# EAGLE design controller_v1.1B (EAGLE 7.2.0)
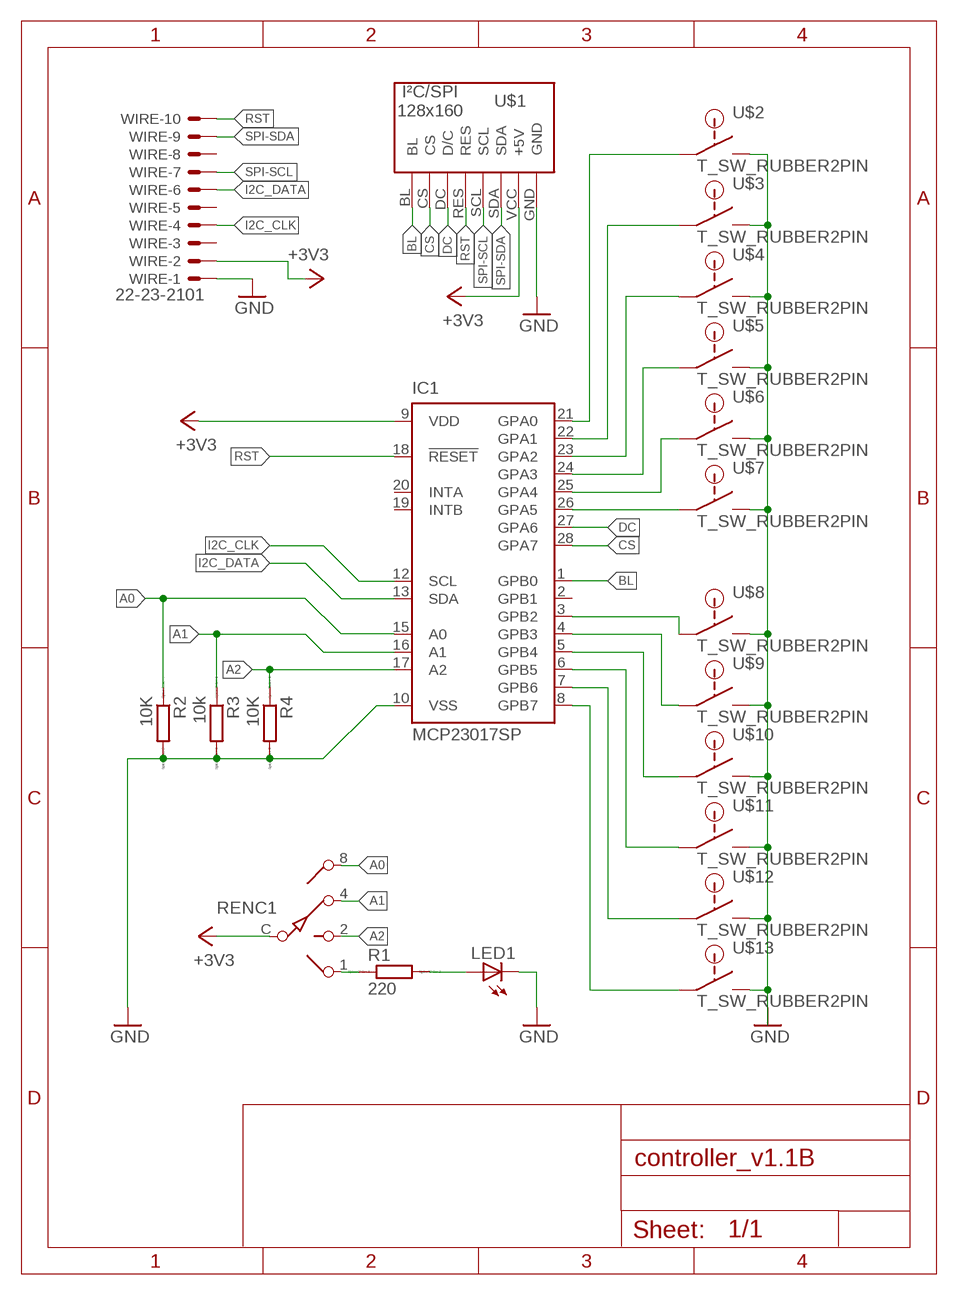
[diagram p0: schematic, sheet 1]

## Parts
IC1  MCP23017SP  [DIL28-3]
LED1  LED3MM  [LED3MM]
R1  220  R0207/10  [0207/10]
R2  10K  R0207/10  [0207/10]
R3  10k  R0207/10  [0207/10]
R4  10K  R0207/10  [0207/10]
RENC1  SW-C10  [SW-C10]
U$1  ST7735_128X160  [128X160_ST7735]
U$2  T_SW_RUBBER2PIN  [2PIN]
U$3  T_SW_RUBBER2PIN  [2PIN]
U$4  T_SW_RUBBER2PIN  [2PIN]
U$5  T_SW_RUBBER2PIN  [2PIN]
U$6  T_SW_RUBBER2PIN  [2PIN]
U$7  T_SW_RUBBER2PIN  [2PIN]
U$8  T_SW_RUBBER2PIN  [2PIN]
U$9  T_SW_RUBBER2PIN  [2PIN]
U$10  T_SW_RUBBER2PIN  [2PIN]
U$11  T_SW_RUBBER2PIN  [2PIN]
U$12  T_SW_RUBBER2PIN  [2PIN]
U$13  T_SW_RUBBER2PIN  [2PIN]
WIRE  22-23-2101  [22-23-2101]

## Nets
+3V3: IC1.9(VDD) RENC1.C U$1.VCC(+5V) WIRE.2
A0: IC1.15(A0) R2.1 RENC1.8
A1: IC1.16(A1) R3.1 RENC1.4
A2: IC1.17(A2) R4.1 RENC1.2
BL: IC1.1(GPB0) U$1.BL
CS: IC1.28(GPA7) U$1.CS
DC: IC1.27(GPA6) U$1.DC(D/C)
GND: IC1.10(VSS) LED1.K(C) R2.2 R3.2 R4.2 U$1.GND U$2.P$3 U$3.P$3 U$4.P$3 U$5.P$3 U$6.P$3 U$7.P$3 U$8.P$3 U$9.P$3 U$10.P$3 U$11.P$3 U$12.P$3 U$13.P$3 WIRE.1
I2C_CLK: IC1.12(SCL) WIRE.4
I2C_DATA: IC1.13(SDA) WIRE.6
N$1: IC1.21(GPA0) U$2.P$2
N$2: R1.1 RENC1.1
N$3: LED1.A R1.2
N$4: IC1.25(GPA4) U$6.P$2
N$5: IC1.24(GPA3) U$5.P$2
N$6: IC1.23(GPA2) U$4.P$2
N$7: IC1.22(GPA1) U$3.P$2
RST: IC1.18(!RESET) U$1.RES WIRE.10
SPI-SCL: U$1.SCL WIRE.7
SPI-SDA: U$1.SDA WIRE.9
SW6: IC1.26(GPA5) U$7.P$2
SW7: IC1.3(GPB2) U$8.P$2
SW8: IC1.4(GPB3) U$9.P$2
SW9: IC1.5(GPB4) U$10.P$2
SW10: IC1.6(GPB5) U$11.P$2
SW11: IC1.7(GPB6) U$12.P$2
SW12: IC1.8(GPB7) U$13.P$2
Unconnected: IC1.2(GPB1) IC1.19(INTB) IC1.20(INTA) WIRE.3 WIRE.5 WIRE.8

## Library data of the parts
IC1 = microchip:MCP23017: http://ww1.microchip.com/downloads/en/DeviceDoc/21952a.pdf Source: http://ww1.microchip.com/downloads/en/DeviceDoc/21952a.pdf; MF: MICROCHIP; MPN: MCP23017-E/SP; OC_FARNELL: 1332088; OC_NEWARK: 31K2959
LED1 = led:LED: LED OSRAM: - CHIPLED LG R971, LG N971, LY N971, LG Q971, LY Q971, LO R971, LY R971 LH N974, LH R974 LS Q976, LO Q976, LY Q976 LO Q996 - Hyper CHIPLED LW Q18S LB Q993, LB Q99A, LB R99A - SideLED LS A670, LO A670, LY A670, LG A670, LP A670 LB A673, LV A673, LT A673, LW A673 LH A674 LY A675 LS A676, LA A676, LO A676, LY A676, LW A676 LS A679, LY A679, LG A679 - Hyper Micro SIDELED® LS Y876, LA Y876, LO Y876, LY Y876 LT Y87S - SmartLED LW L88C, LW L88S LB L89C, LB L89S, LG L890 LS L89K, LO L89K, LY L89K LS L896, LA L896, LO L896, LY L896 - TOPLED LS T670, LO T670, LY T670, LG T670, LP T670 LSG T670, LSP T670, LSY T670, LOP T670, LYG T670 LG T671, LOG T671, LSG T671 LB T673, LV T673, LT T673, LW T673 LH T674 LS T676, LA T676, LO T676, LY T676, LB T676, LH T676, LSB T676, LW T676 LB T67C, LV T67C, LT T67C, LS T67K, LO T67K, LY T67K, LW E67C LS E67B, LA E67B, LO E67B, LY E67B, LB E67C, LV E67C, LT E67C LW T67C LS T679, LY T679, LG T679 LS T770, LO T770, LY T770, LG T770, LP T770 LB T773, LV T773, LT T773, LW T773 LH T774 LS E675, LA E675, LY E675, LS T675 LS T776, LA T776, LO T776, LY T776, LB T776 LHGB T686 LT T68C, LB T68C - Hyper Mini TOPLED® LB M676 - Mini TOPLED Santana® LG M470 LS M47K, LO M47K, LY M47K Source: http://www.osram.convergy.de LUXEON: - LUMILED® LXK2-PW12-R00, LXK2-PW12-S00, LXK2-PW14-U00, LXK2-PW14-V00 LXK2-PM12-R00, LXK2-PM12-S00, LXK2-PM14-U00 LXK2-PE12-Q00, LXK2-PE12-R00, LXK2-PE12-S00, LXK2-PE14-T00, LXK2-PE14-U00 LXK2-PB12-K00, LXK2-PB12-L00, LXK2-PB12-M00, LXK2-PB14-N00, LXK2-PB14-P00, LXK2-PB14-Q00 LXK2-PR12-L00, LXK2-PR12-M00, LXK2-PR14-Q00, LXK2-PR14-R00 LXK2-PD12-Q00, LXK2-PD12-R00, LXK2-PD12-S00 LXK2-PH12-R00, LXK2-PH12-S00 LXK2-PL12-P00, LXK2-PL12-Q00, LXK2-PL12-R00 Source: www.luxeon.com KINGBRIGHT: KA-3528ASYC Source: www.kingbright.com
R1-R4 = eagle-ltspice:R: RESISTOR, European symbol; SPICEMODEL: NONE; SPICEPREFIX: R
RENC1 = special:SW-C10: SWITCH 10-step rotary switch
U$1 = display:ST7735_128X160
U$2-U$13 = switch:T_SW_RUBBER
WIRE = con-molex:22-23-2101: .100" (2.54mm) Center Header - 10 Pin; MF: MOLEX; MPN: Wire-connection; OC_FARNELL: 1756828; OC_NEWARK: 94C0765

## Board
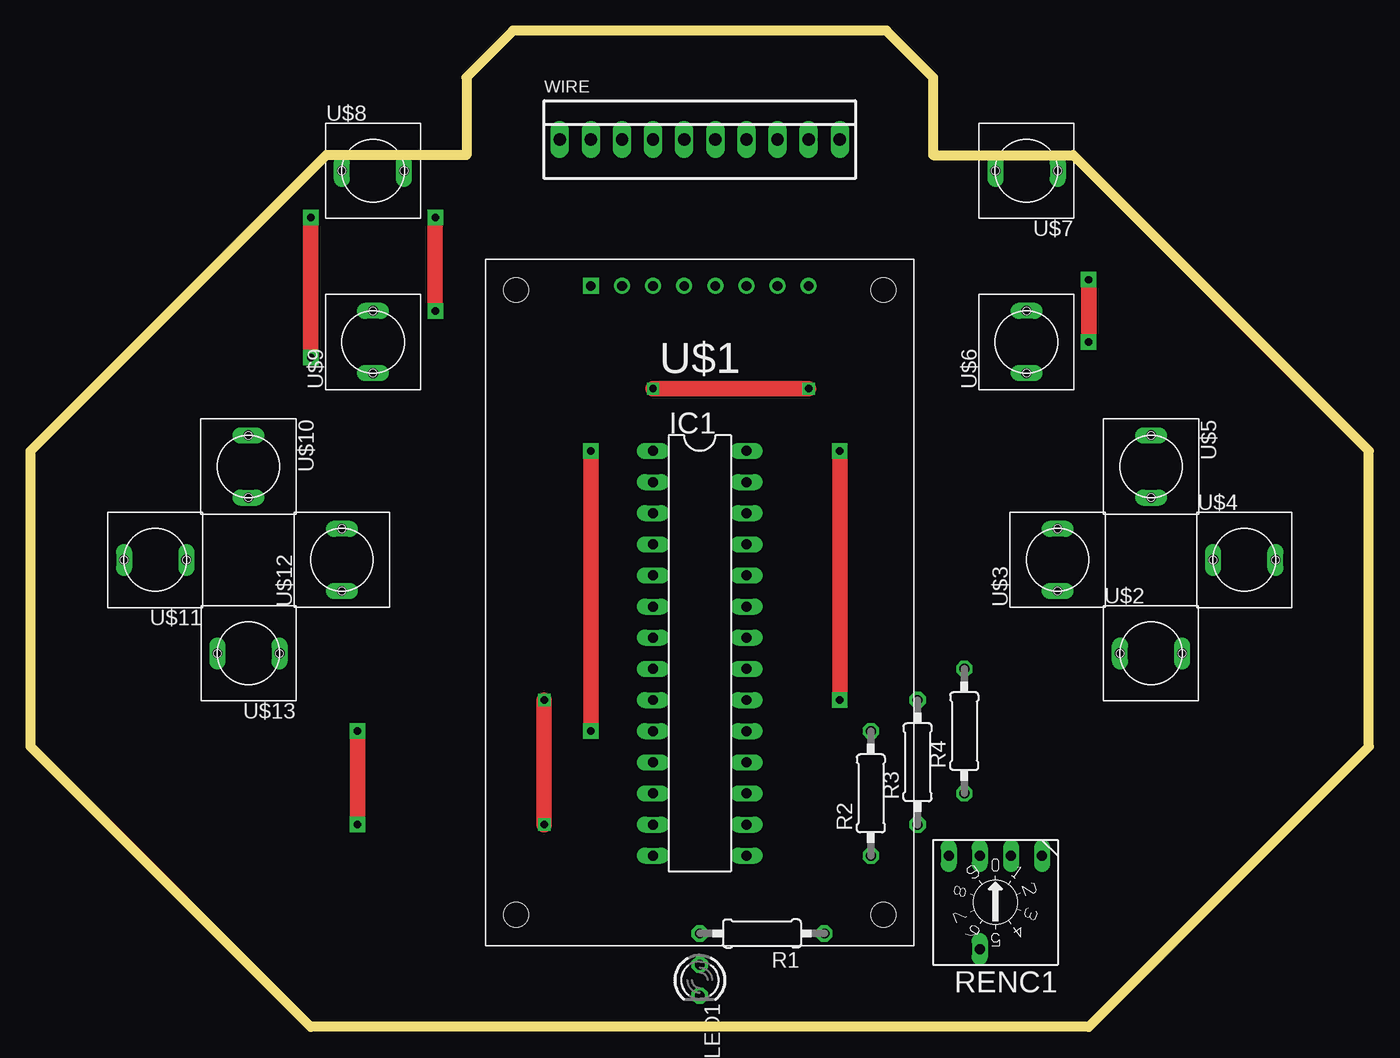
[diagram p1: board, top side]
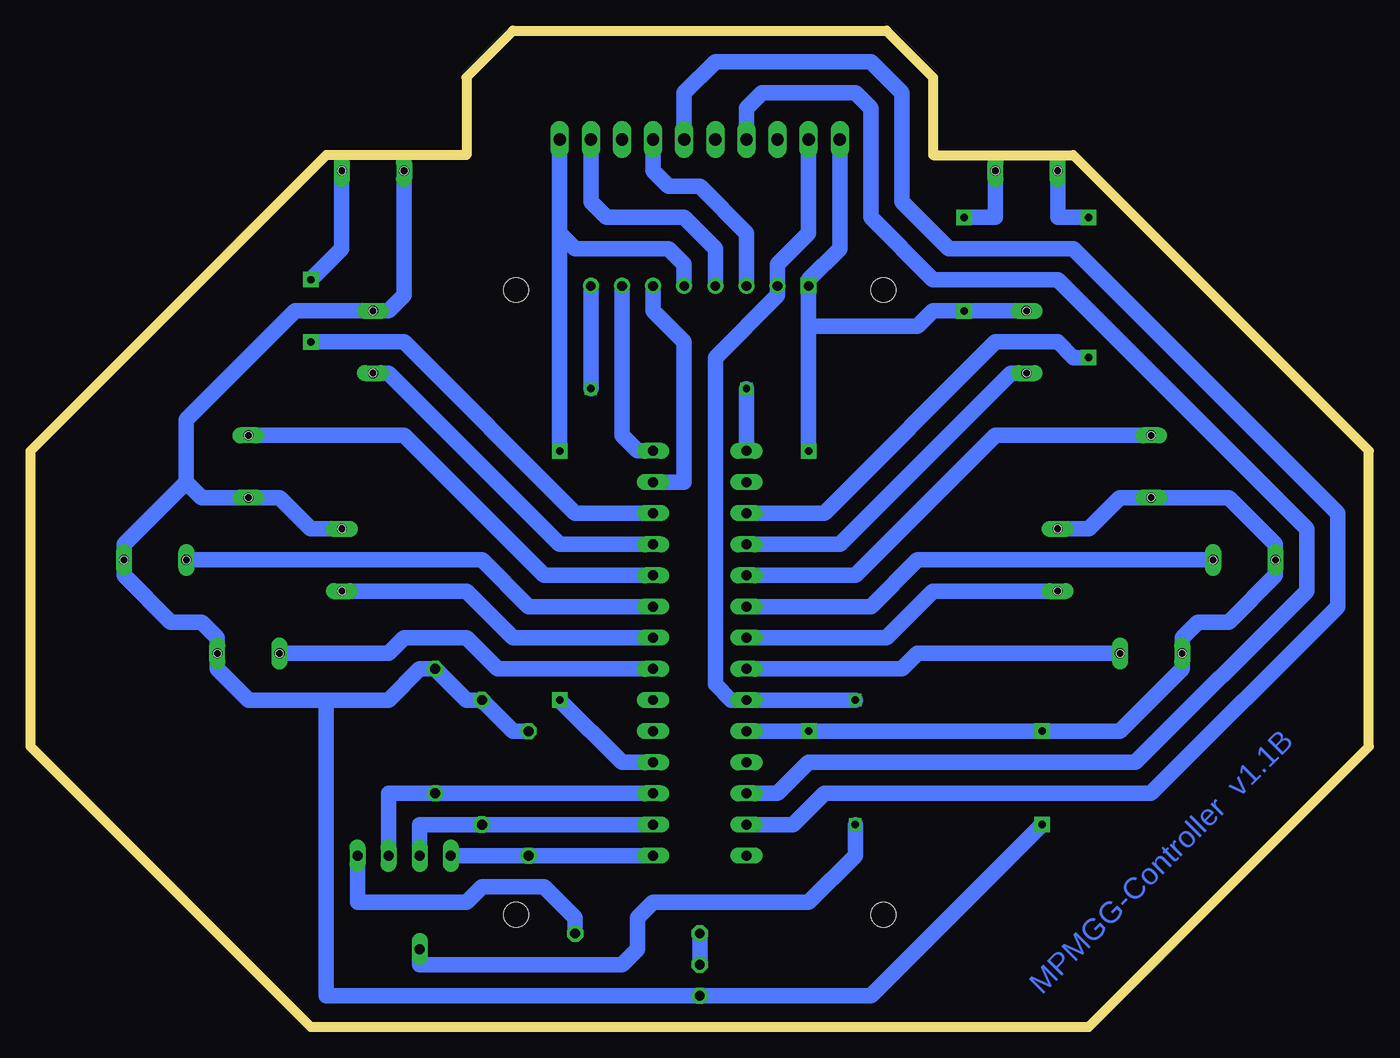
[diagram p2: board, bottom side, seen from below]

Size 109.22 x 81.28 mm. Coordinates in mm from the lower left corner, seen from the top.
Outline: 86.36,0 22.86,0 0,22.86 0,46.99 24.13,71.12 35.56,71.12 35.56,77.47 39.37,81.28 69.85,81.28 73.66,77.47 73.66,71.12 85.09,71.12 109.22,46.99 109.22,22.86 86.36,0
Copper layers (1*16): Top 0.035mm / dielectric 1.5mm / Bottom 0.035mm
Design rules "default": minimum track width 10mil, minimum drill 24mil, track to track 8mil, track to pad 8mil, pad to pad 8mil, via to via 8mil, smd to smd 8mil, copper to edge 40mil, drill to drill 8mil, minimum pad ring 10mil, minimum via ring 8mil, stop-mask expansion 4mil, vias tented up to drill 0mil, thermal gap 10mil

### Footprints (pad centres in the part's own frame; a part is rotated, then mirrored left to right if it is on the bottom)
DIL28-3 = drill 0.813 long: 1 -16.51,-3.81; 2 -13.97,-3.81; 3 -11.43,-3.81; 4 -8.89,-3.81; 5 -6.35,-3.81; 6 -3.81,-3.81; 7 -1.27,-3.81; 8 1.27,-3.81; 9 3.81,-3.81; 10 6.35,-3.81; 11 8.89,-3.81; 12 11.43,-3.81; 13 13.97,-3.81; 14 16.51,-3.81; 15 16.51,3.81; 16 13.97,3.81; 17 11.43,3.81; 18 8.89,3.81; 19 6.35,3.81; 20 3.81,3.81; 21 1.27,3.81; 22 -1.27,3.81; 23 -3.81,3.81; 24 -6.35,3.81; 25 -8.89,3.81; 26 -11.43,3.81; 27 -13.97,3.81; 28 -16.51,3.81
LED3MM = drill 0.813 octagon: A -1.27,0; K 1.27,0
0207/10 = drill 0.813 octagon: 1 -5.08,0; 2 5.08,0
SW-C10 = drill 0.813 long: 1 -3.81,-3.81; 2 -1.27,-3.81; 4 1.27,-3.81; 8 3.81,-3.81; C 1.27,3.81
128X160_ST7735 = drill 0.8: BL 8.89,5.842; CS 6.35,5.842; DC 3.81,5.842; RES 1.27,5.842; SCL -3.81,5.842; SDA -1.27,5.842; VCC -6.35,5.842 | drill 0.8 square: GND -8.89,5.842 | hole 2: -15,5.5; 15,5.5; -15,-45.466; 15,-45.466
2PIN = drill 0.8 long: P$2 -2.54,0; P$3 2.54,0 | hole 0.6: -2.54,0; 2.54,0
22-23-2101 = drill 1 long: 1 -11.43,0; 2 -8.89,0; 3 -6.35,0; 4 -3.81,0; 5 -1.27,0; 6 1.27,0; 7 3.81,0; 8 6.35,0; 9 8.89,0; 10 11.43,0

### Placement (x,y rotation side)
IC1  54.61,30.48 270 top
LED1  54.61,3.81 270 top
R1  59.69,7.62 180 top
R2  68.58,19.05 90 top
R3  72.39,21.59 90 top
R4  76.2,24.13 90 top
RENC1  78.74,10.16 180 top
U$1  54.61,54.61 0 top
U$2  91.44,30.48 0 top
U$3  83.82,38.1 90 top
U$4  99.06,38.1 0 top
U$5  91.44,45.72 270 top
U$6  81.28,55.88 90 top
U$7  81.28,69.85 180 top
U$8  27.94,69.85 0 top
U$9  27.94,55.88 90 top
U$10  17.78,45.72 270 top
U$11  10.16,38.1 180 top
U$12  25.4,38.1 90 top
U$13  17.78,30.48 180 top
WIRE  54.61,72.39 0 top

### Tracks (layer width: path | path; a pad name or v marks a point on that pad's centre or on a via)
+3V3  (via drill 0.6)
  Top 1.27: v41.91,26.67 v41.91,16.51
  Bottom 1.27: WIRE.2 45.72,64.77 48.26,62.23 U$1.VCC 48.26,59.69 53.34,54.61 53.34,27.94 52.07,26.67 IC1.9 v41.91,26.67 | v41.91,16.51 41.91,13.97 45.72,10.16 58.42,10.16 59.69,8.89 59.69,6.35 60.96,5.08 77.47,5.08 RENC1.C
A0
  Bottom 1.27: IC1.15 R2.1 RENC1.8
A1
  Bottom 1.27: IC1.16 R3.1 77.47,16.51 RENC1.4
A2
  Bottom 1.27: IC1.17 R4.1 80.01,19.05 RENC1.2
BL  (via drill 0.6)
  Top 1.27: v63.5,52.07 v50.8,52.07
  Bottom 1.27: U$1.BL v63.5,52.07 | v50.8,52.07 IC1.1
CS
  Bottom 1.27: U$1.CS 60.96,48.26 59.69,46.99 IC1.28
DC
  Bottom 1.27: IC1.27 55.88,44.45 55.88,55.88 58.42,58.42 U$1.DC
GND  (via drill 0.6 pad 1.27)
  Top 1.27: v45.72,24.13 v45.72,46.99 | v26.67,24.13 v26.67,16.51 | v33.02,66.04 v33.02,58.42
  Bottom 1.27: 85.09,26.67 91.44,26.67 93.98,29.21 U$2.P$3 93.98,31.75 95.25,33.02 97.79,33.02 101.6,36.83 U$4.P$3 101.6,39.37 96.52,44.45 | U$3.P$3 86.36,40.64 88.9,43.18 U$5.P$3 95.25,43.18 96.52,44.45 | U$12.P$3 22.86,40.64 20.32,43.18 U$10.P$3 11.43,43.18 7.62,39.37 U$11.P$3 7.62,36.83 11.43,33.02 13.97,33.02 15.24,31.75 U$13.P$3 15.24,29.21 20.32,24.13 v26.67,24.13 v45.72,24.13 IC1.10 | v45.72,46.99 45.72,57.15 | 45.72,57.15 U$1.GND 45.72,60.96 43.18,63.5 WIRE.1 | R2.2 69.85,24.13 R3.2 73.66,26.67 R4.2 77.47,29.21 80.01,26.67 85.09,26.67 | 85.09,26.67 85.09,2.54 LED1.K 40.64,2.54 v26.67,16.51 | 96.52,44.45 96.52,49.53 87.63,58.42 U$6.P$3 80.01,58.42 78.74,59.69 U$7.P$3 | U$8.P$3 30.48,66.04 v33.02,66.04 | U$9.P$3 v33.02,58.42 35.56,58.42 36.83,57.15 45.72,57.15
I2C_CLK
  Bottom 1.27: WIRE.4 50.8,74.93 49.53,76.2 41.91,76.2 40.64,74.93 40.64,66.04 35.56,60.96 25.4,60.96 5.08,40.64 5.08,35.56 19.05,21.59 45.72,21.59 48.26,19.05 IC1.12
I2C_DATA
  Bottom 1.27: WIRE.6 55.88,76.2 53.34,78.74 40.64,78.74 38.1,76.2 38.1,67.31 34.29,63.5 24.13,63.5 2.54,41.91 2.54,34.29 17.78,19.05 44.45,19.05 46.99,16.51 IC1.13
N$1
  Bottom 1.27: U$2.P$2 80.01,30.48 78.74,31.75 73.66,31.75 71.12,29.21 IC1.21
N$2
  Bottom 1.27: RENC1.1 82.55,10.16 73.66,10.16 72.39,11.43 67.31,11.43 64.77,8.89 R1.1
N$3
  Bottom 1.27: R1.2 LED1.A
N$4
  Bottom 1.27: IC1.25 66.04,39.37 80.01,53.34 U$6.P$2
N$5
  Bottom 1.27: IC1.24 67.31,36.83 78.74,48.26 U$5.P$2
N$6
  Bottom 1.27: U$4.P$2 72.39,38.1 68.58,34.29 IC1.23
N$7
  Bottom 1.27: U$3.P$2 73.66,35.56 69.85,31.75 IC1.22
RST  (via drill 0.6 pad 1.27)
  Top 1.27: v66.04,46.99 v66.04,26.67
  Bottom 1.27: 66.04,64.77 WIRE.10 | U$1.RES 55.88,62.23 57.15,63.5 64.77,63.5 66.04,64.77 | 66.04,64.77 v66.04,46.99 | v66.04,26.67 60.96,21.59 IC1.18
SPI-SCL
  Bottom 1.27: U$1.SCL 50.8,64.77 54.61,68.58 57.15,68.58 58.42,69.85 WIRE.7
SPI-SDA
  Bottom 1.27: U$1.SDA 53.34,63.5 55.88,66.04 62.23,66.04 63.5,67.31 WIRE.9
SW6  (via drill 0.6 pad 1.27)
  Top 1.27: v86.36,60.96 v86.36,55.88
  Bottom 1.27: U$7.P$2 83.82,63.5 v86.36,60.96 | v86.36,55.88 78.74,55.88 64.77,41.91 IC1.26
SW7  (via drill 0.6 pad 1.27)
  Top 1.27: v22.86,66.04 v22.86,54.61
  Bottom 1.27: U$8.P$2 25.4,66.04 v22.86,66.04 | v22.86,54.61 24.13,54.61 25.4,55.88 30.48,55.88 44.45,41.91 IC1.3
SW8
  Bottom 1.27: IC1.4 43.18,39.37 29.21,53.34 U$9.P$2
SW9
  Bottom 1.27: IC1.5 41.91,36.83 30.48,48.26 U$10.P$2
SW10
  Bottom 1.27: U$11.P$2 36.83,38.1 40.64,34.29 IC1.6
SW11
  Bottom 1.27: U$12.P$2 35.56,35.56 39.37,31.75 IC1.7
SW12
  Bottom 1.27: IC1.8 38.1,29.21 36.83,30.48 U$13.P$2

### Text on the board
Bottom: MPMGG-Controller v1.1B